# EasyEDA schematic KegWasher_1.11_HCRelay_Schematic_EasyEDA.json
TITLE: Keg Washer Pi 1.11 HV Relay; REV: v1.10; Date: 2021-06-14; Sheet: 1/1; Drawn By: Kyle Hultman; Company: Kyle Hultman
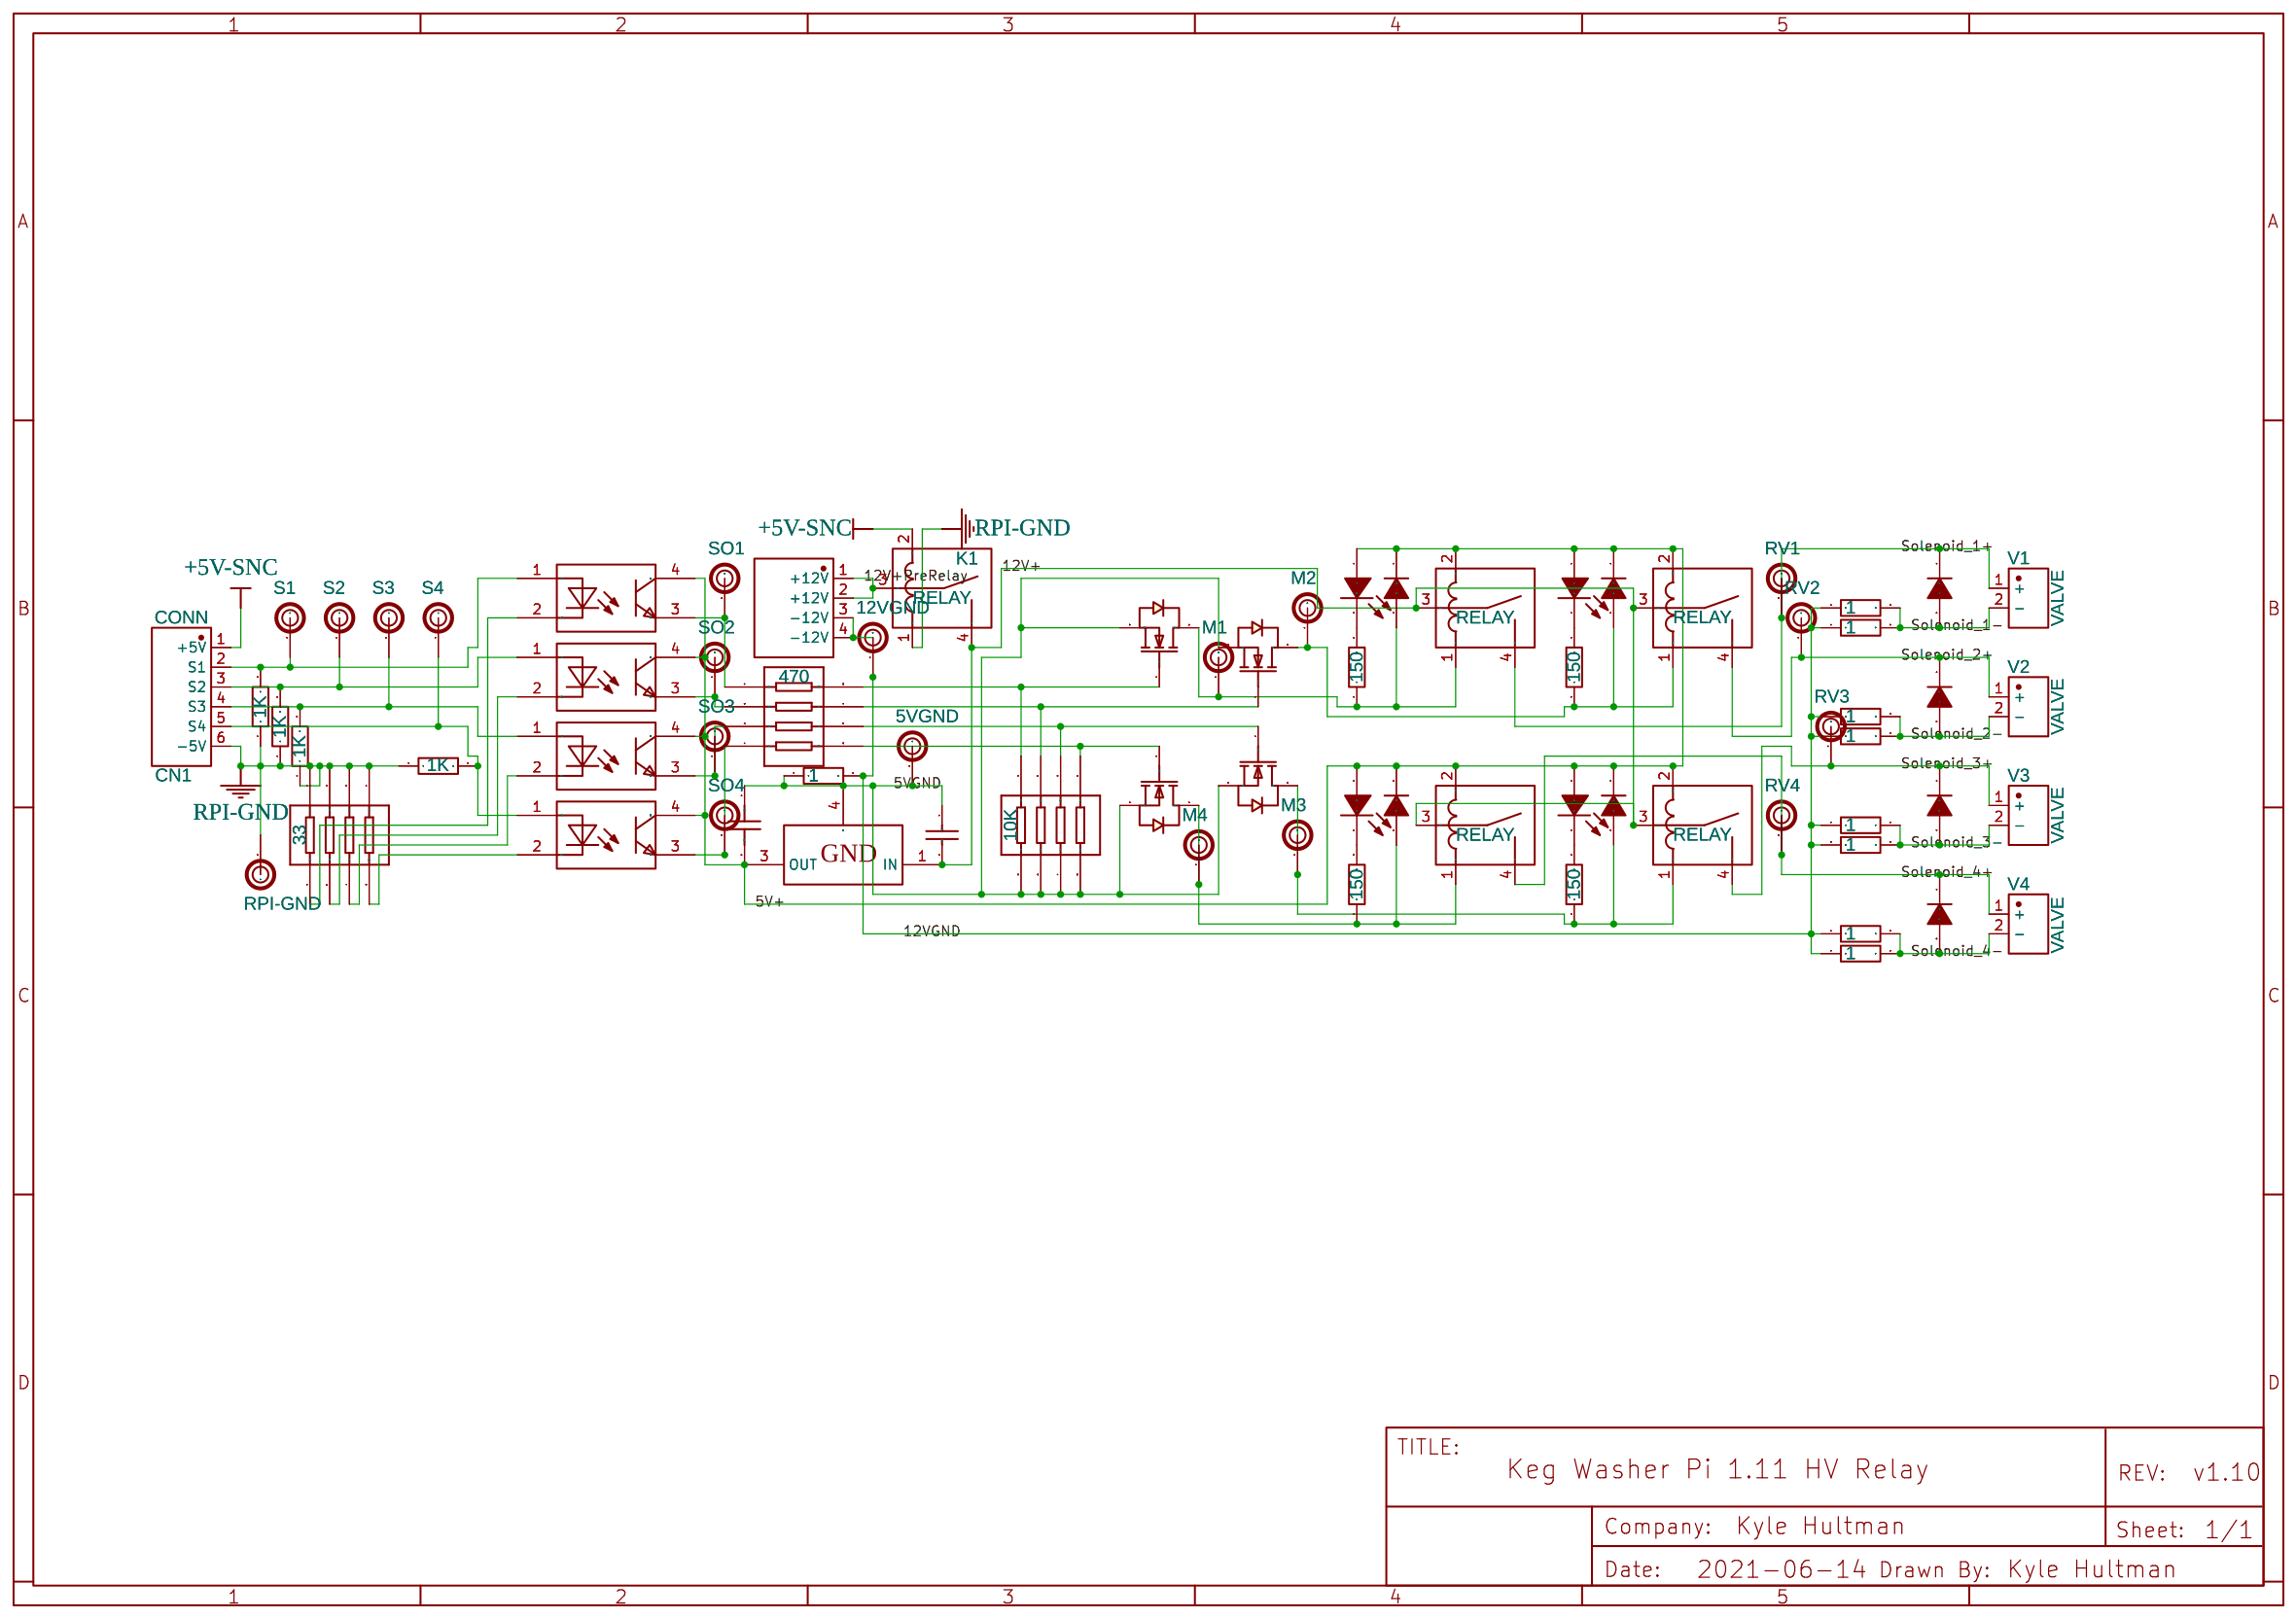
[diagram p0: schematic sheet]

## Parts
5VGND  TestPoint  [TESTPOINT]
12VGND  TestPoint  [TESTPOINT]
C1  330nF  [C0805]
C2  100nF  [C0603]
CN1  CONN  [6P]
D1  1N4148WS T4  [SOD-323_L1.8-W1.3-LS2.5-RD]
D2  1N4148WS T4  [SOD-323_L1.8-W1.3-LS2.5-RD]
D3  1N4148WS T4  [SOD-323_L1.8-W1.3-LS2.5-RD]
D4  1N4148WS T4  [SOD-323_L1.8-W1.3-LS2.5-RD]
D5  1N4148WS T4  [SOD-323_L1.8-W1.3-LS2.5-RD]
D6  1N4148WS T4  [SOD-323_L1.8-W1.3-LS2.5-RD]
D7  1N4148WS T4  [SOD-323_L1.8-W1.3-LS2.5-RD]
D8  1N4148WS T4  [SOD-323_L1.8-W1.3-LS2.5-RD]
K1  RELAY  [RELAY-TH_CMA51H-X-XX-A]
K2  RELAY  [RELAY-TH_CMA51H-X-XX-A]
K3  RELAY  [RELAY-TH_CMA51H-X-XX-A]
K4  RELAY  [RELAY-TH_CMA51H-X-XX-A]
K5  RELAY  [RELAY-TH_CMA51H-X-XX-A]
LED9  KT-0603R  [LED0603-R-RD]
LED10  KT-0603R  [LED0603-R-RD]
LED11  KT-0603R  [LED0603-R-RD]
LED12  KT-0603R  [LED0603-R-RD]
M1  TestPoint  [TESTPOINT]
M2  TestPoint  [TESTPOINT]
M3  TestPoint  [TESTPOINT]
M4  TestPoint  [TESTPOINT]
PWR1  12vHC-IN  [4P]
Q1  AO3400A  [SOT-23-3_L2.9-W1.6-P1.90-LS2.8-BR]
Q2  AO3400A  [SOT-23-3_L2.9-W1.6-P1.90-LS2.8-BR]
Q3  AO3400A  [SOT-23-3_L2.9-W1.6-P1.90-LS2.8-BR]
Q4  AO3400A  [SOT-23-3_L2.9-W1.6-P1.90-LS2.8-BR]
R1  150  [R0603]
R2  150  [R0603]
R3  150  [R0603]
R4  150  [R0603]
R5  1K  [R0402]
R6  1K  [R0402]
R7  1K  [R0402]
R8  1K  [R0402]
R9  1  [R1206]
R10  1  [R1206]
R11  1  [R1206]
R12  1  [R1206]
R13  1  [R1206]
R14  1  [R1206]
R15  1  [R1206]
R16  1  [R1206]
R17  1  [R1206]
RN1  33  [RES-ARRAY-SMD_0402-8P-L2.0-W1.0-BL]
RN2  470  [RES-ARRAY-SMD_0603-8P-L3.2-W1.6-BL]
RN3  10K  [RES-ARRAY-SMD_0402-8P-L2.0-W1.0-BL]
RPI-GND  TestPoint  [TESTPOINT]
RV1  TestPoint  [TESTPOINT]
RV2  TestPoint  [TESTPOINT]
RV3  TestPoint  [TESTPOINT]
RV4  TestPoint  [TESTPOINT]
S1  TestPoint  [TESTPOINT]
S2  TestPoint  [TESTPOINT]
S3  TestPoint  [TESTPOINT]
S4  TestPoint  [TESTPOINT]
SO1  TestPoint  [TESTPOINT]
SO2  TestPoint  [TESTPOINT]
SO3  TestPoint  [TESTPOINT]
SO4  TestPoint  [TESTPOINT]
U1  EL357N(B)(TA)-G  [OPTO-SMD-4_L4.4-W4.1-P2.54-LS7.0-TL]
U2  EL357N(B)(TA)-G  [OPTO-SMD-4_L4.4-W4.1-P2.54-LS7.0-TL]
U3  EL357N(B)(TA)-G  [OPTO-SMD-4_L4.4-W4.1-P2.54-LS7.0-TL]
U4  EL357N(B)(TA)-G  [OPTO-SMD-4_L4.4-W4.1-P2.54-LS7.0-TL]
U5  L78M05ABDT-TR  [TO-252-2_L6.5-W6.1-P4.58-LS10.0-TL]
V1  VALVE  [2P]
V2  VALVE  [2P]
V3  VALVE  [2P]
V4  VALVE  [2P]

## Library data of the parts
5VGND 12VGND M1-M4 RPI-GND RV1-RV4 S1-S4 SO1-SO4 = TestPoint: Contributor: danaz
C1 = 0805B334K500NT: Supplier: LCSC; Manufacturer: FH; Supplier Part: C1740; JLCPCB Part Class: Basic Part
C2 = CC0603KRX7R9BB104: Supplier: LCSC; Manufacturer: YAGEO; Supplier Part: C14663; JLCPCB Part Class: Basic Part
CN1 = CONN
D1-D8 = 1N4148WS T4: Supplier: LCSC; Manufacturer: CJ; Supplier Part: C2128; JLCPCB Part Class: Basic Part
K1-K5 = CMA51H-S-DC5V-A: Supplier: LCSC; Supplier Part: C125687; Manufacturer: Zhejiang HKE; Contributor: LCSC
LED9-LED12 = KT-0603R: Supplier: LCSC; Manufacturer: KENTO; Supplier Part: C2286; JLCPCB Part Class: Basic Part
PWR1 = 12vHC-IN
Q1-Q4 = AO3400A: Supplier: LCSC; Manufacturer: AOS; Supplier Part: C20917
R1-R4 = 0603WAF1500T5E: Supplier: LCSC; Manufacturer: UniOhm; Supplier Part: C22808; JLCPCB Part Class: Basic Part
R5-R8 = 0402WGF1001TCE: Supplier: LCSC; Manufacturer: UniOhm; Supplier Part: C11702; JLCPCB Part Class: Basic Part
R9-R17 = 1206W4F100KT5E: Supplier: LCSC; Manufacturer: UniOhm; Supplier Part: C17928; JLCPCB Part Class: Basic Part
RN1 = 4D02WGJ0330TCE: Supplier: LCSC; Manufacturer: UniOhm; Supplier Part: C25501; JLCPCB Part Class: Basic Part
RN2 = 4D03WGJ0471T5E: Supplier: LCSC; Manufacturer: UniOhm; Supplier Part: C25510; JLCPCB Part Class: Basic Part
RN3 = 4D02WGJ0103TCE: Supplier: LCSC; Manufacturer: UniOhm; Supplier Part: C25725; JLCPCB Part Class: Basic Part
U1-U4 = EL357N(B)(TA)-G: Supplier: LCSC; Manufacturer: EVERLIGHT; Supplier Part: C6649; Paste Type: Basic Part; JLCPCB Part Class: Basic Part
U5 = L78M05ABDT-TR: Supplier: LCSC; Manufacturer: STMicroelectronics; Supplier Part: C58069; JLCPCB Part Class: Basic Part
V1-V3 = VALVE
V4 = RELAY

## Nets
5V+: C2.2 D1.1(K) D2.1(K) D3.1(K) D4.1(K) K2.2 K3.2 K4.2 K5.2 LED9.1(A) LED10.1(A) LED11.1(A) LED12.1(A) U1.4(COL) U2.4(COL) U3.4(COL) U4.4(COL) U5.3(OUT)
5VGND: 5VGND.1 C1.1 C2.1 Q1.2(S) Q2.2(S) Q3.2(S) Q4.2(S) R17.1 RN3.5 RN3.6 RN3.7 RN3.8 U5.4(GND)
12V+: C1.2 K1.4 K2.3 K3.3 K4.3 K5.3 U5.1(IN)
12V+PreRelay: K1.3 PWR1.1(+12V) PWR1.2(+12V)
12VGND: 12VGND.1 PWR1.3(-12V) PWR1.4(-12V) R9.1 R10.1 R11.1 R12.1 R13.1 R14.1 R15.1 R16.1 R17.2
+5V-SNC: CN1.1(+5V) K1.2
RPI-GND: CN1.6(-5V) K1.1 R5.1 R6.1 R7.1 R8.1 RN1.1 RN1.2 RN1.3 RN1.4 RPI-GND.1
Solenoid_1+: D5.1(K) K2.4 RV1.1 V1.1(+)
Solenoid_1-: D5.2(A) R9.2 R10.2 V1.2(-)
Solenoid_2+: D6.1(K) K3.4 RV2.1 V2.1(+)
Solenoid_2-: D6.2(A) R11.2 R12.2 V2.2(-)
Solenoid_3+: D7.1(K) K4.4 RV3.1 V3.1(+)
Solenoid_3-: D7.2(A) R13.2 R14.2 V3.2(-)
Solenoid_4+: D8.1(K) K5.4 RV4.1 V4.1(+)
Solenoid_4-: D8.2(A) R15.2 R16.2 V4.2(-)
Net-(CN1-2): CN1.2(S1) R5.2 S1.1 U1.1(AN)
Net-(CN1-3): CN1.3(S2) R6.2 S2.1 U2.1(AN)
Net-(CN1-4): CN1.4(S3) R7.2 S3.1 U3.1(AN)
Net-(CN1-5): CN1.5(S4) R8.2 S4.1 U4.1(AN)
Net-(D1-2): D1.2(A) K2.1 M1.1 Q1.3(D) R1.1
Net-(D2-2): D2.2(A) K3.1 M2.1 Q2.3(D) R2.1
Net-(D3-2): D3.2(A) K4.1 M3.1 Q3.3(D) R3.1
Net-(D4-2): D4.2(A) K5.1 M4.1 Q4.3(D) R4.1
Net-(LED9-2): LED9.2(K) R1.2
Net-(LED10-2): LED10.2(K) R2.2
Net-(LED11-2): LED11.2(K) R3.2
Net-(LED12-2): LED12.2(K) R4.2
Net-(Q1-1): Q1.1(G) RN2.8 RN3.4
Net-(Q2-1): Q2.1(G) RN2.7 RN3.3
Net-(Q3-1): Q3.1(G) RN2.6 RN3.2
Net-(Q4-1): Q4.1(G) RN2.5 RN3.1
Net-(RN1-5): RN1.5 U1.2(CAT)
Net-(RN1-6): RN1.6 U2.2(CAT)
Net-(RN1-7): RN1.7 U3.2(CAT)
Net-(RN1-8): RN1.8 U4.2(CAT)
Net-(RN2-1): RN2.1 SO1.1 U1.3(EM)
Net-(RN2-2): RN2.2 SO2.1 U2.3(EM)
Net-(RN2-3): RN2.3 SO3.1 U3.3(EM)
Net-(RN2-4): RN2.4 SO4.1 U4.3(EM)
